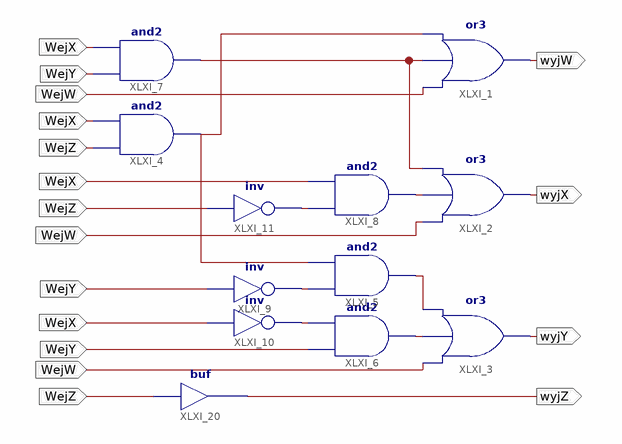
[diagram p0: schematic sheet 1]
// Xilinx ISE schematic schematic_zad3.sch (xc9500xl) as structural Verilog: 12 symbols, 8 ports
module schematic_zad3 (
  input  WejW,
  input  WejY,
  input  WejX,
  input  WejZ,
  output wyjX,
  output wyjW,
  output wyjZ,
  output wyjY
);

  wire XLXN_1, XLXN_2, XLXN_3, XLXN_4, XLXN_5, XLXN_12, XLXN_15, XLXN_16;

  or XLXI_1 (wyjW, WejW, XLXN_1, XLXN_2);
  or XLXI_2 (wyjX, WejW, XLXN_5, XLXN_1);
  and XLXI_7 (XLXN_1, WejY, WejX);
  and XLXI_8 (XLXN_5, XLXN_12, WejX);
  not XLXI_11 (XLXN_12, WejZ);
  and XLXI_4 (XLXN_2, WejZ, WejX);
  buf XLXI_20 (wyjZ, WejZ);
  not XLXI_10 (XLXN_16, WejX);
  not XLXI_9 (XLXN_15, WejY);
  and XLXI_5 (XLXN_3, XLXN_15, XLXN_2);
  and XLXI_6 (XLXN_4, WejY, XLXN_16);
  or XLXI_3 (wyjY, WejW, XLXN_4, XLXN_3);
endmodule
